# Altium schematic sheet Accumulator_DC-DC.SchDoc
size A4
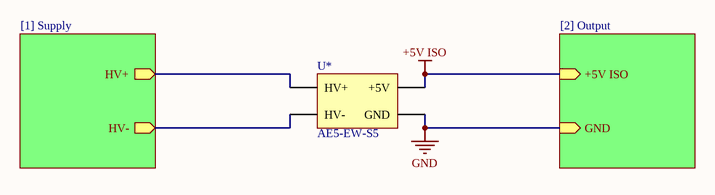
[diagram p0: Accumulator_DC-DC.SchDoc]

## Parts
U*  AE5-EW-S5

## Sub-sheets
Output = [2] Output: GND (in), +5V ISO (in)
Supply = [1] Supply: HV+ (out), HV- (out)

## Nets
+5V ISO: U*.+5V ; sheet Output/+5V ISO
GND: U*.GND ; sheet Output/GND
NetU*_HV+: U*.HV+ ; sheet Supply/HV+
NetU*_HV-: U*.HV- ; sheet Supply/HV-

## Notes on the sheet
- Title
- Size:
- Date:
- A4
- Number:
- Time:
- Revision:
- Sheet
- of
- File:

## Library data of the parts
U* = DCDC-ISO-1000V/5V-1A: dc-dc isolated, 5 W, 100~1000 Vdc input, 5V, 1 A, DIP, ext temp; Manufacturer 1: CUI; ComponentLink1URL: https://www.mouser.es/datasheet/2/670/ae5_ew-1774237.pdf; ComponentLink1Description: Datasheet; ComponentLink2Description: Where buy it; ComponentLink2URL: https://www.mouser.es/ProductDetail/CUI-Inc/AE5-EW-S5?qs=f9yNj16SXrJNGSJA82%2F47g%3D%3D; Supplier 1: Digi-Key; RoHS: Yes; Category: Board Mount Modules; Stock 1: 12; Pricing 1: 1=50,11000, 5=49,72000 (USD); RoHS Compliant: No; Supplier Part Number 1: 102-4489-ND; Manufacturer Part Number 1: AE5-EW-S5